# EAGLE schematic fet_h220 (EAGLE 5.06)
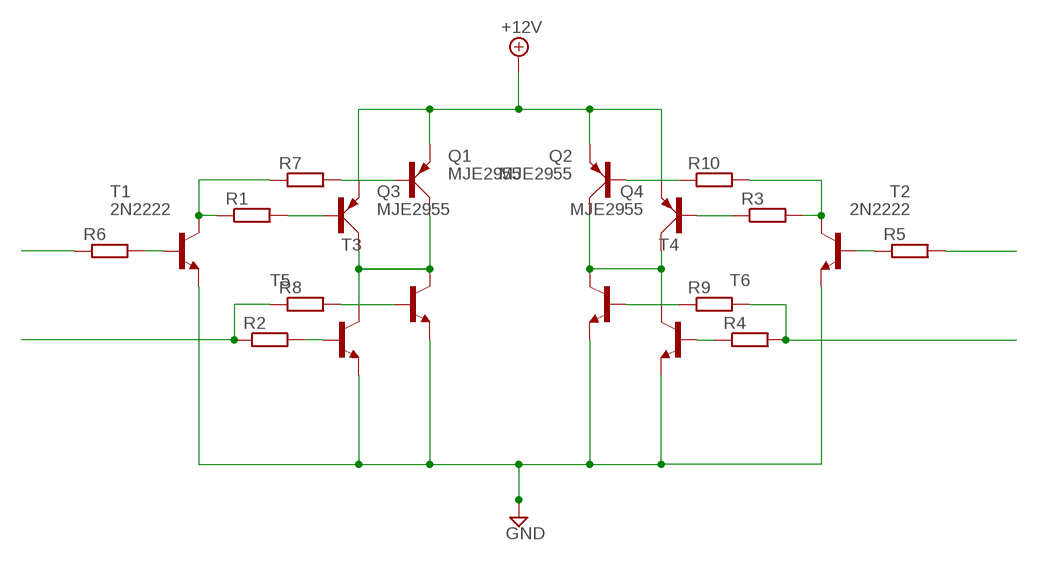
[diagram p0: schematic, sheet 1]

## Parts
Q1  MJE2955  [TO220AV]
Q2  MJE2955  [TO220AV]
Q3  MJE2955  [TO220AV]
Q4  MJE2955  [TO220AV]
R1  R-EU_0204/7  [0204/7]
R2  R-EU_0204/7  [0204/7]
R3  R-EU_0204/7  [0204/7]
R4  R-EU_0204/7  [0204/7]
R5  R-EU_0204/7  [0204/7]
R6  R-EU_0204/7  [0204/7]
R7  R-EU_0204/7  [0204/7]
R8  R-EU_0204/7  [0204/7]
R9  R-EU_0204/7  [0204/7]
R10  R-EU_0204/7  [0204/7]
T1  2N2222  [TO18]
T2  2N2222  [TO18]
T3  -NPN-TO220V  [TO220V]
T4  -NPN-TO220V  [TO220V]
T5  -NPN-TO220V  [TO220V]
T6  -NPN-TO220V  [TO220V]

## Nets
+12V: Q1.E Q2.E Q3.E Q4.E
GND: T1.1(E) T2.1(E) T3.3(E) T4.3(E) T5.3(E) T6.3(E)
N$1: R1.1 R7.1 T1.3(C)
N$2: Q3.B R1.2
N$3: Q2.C Q4.C T4.2(C) T6.2(C)
N$4: R4.2 R9.2
N$7: R4.1 T6.1(B)
N$8: Q4.B R3.1
N$9: R2.2 T5.1(B)
N$10: R6.2 T1.2(B)
N$11: R5.1 T2.2(B)
N$12: R3.2 R10.2 T2.3(C)
N$13: Q1.B R7.2
N$15: R5.2
N$17: Q1.C Q3.C T3.2(C) T5.2(C)
N$22: Q2.B R10.1
N$23: R9.1 T4.1(B)
N$24: R8.2 T3.1(B)
N$27: R2.1 R8.1
N$28: R6.1

## Library data of the parts
Q1-Q4 = transistor-power:MJE2955: PNP TRANSISTOR
R1-R10 = resistor:R-EU_: RESISTOR, European symbol
T1 T2 = transistor:2N2222: NPN TRANSISTOR
T3-T6 = transistor-neu-to92:*-NPN-: NPN Transistror